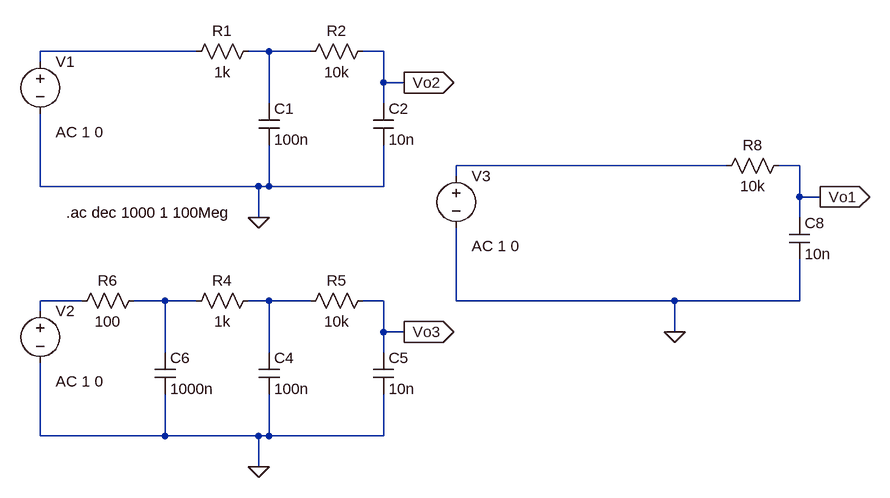
[diagram p0: schematic q4.asc]
q4.asc, the LTspice schematic file:
Version 4
SHEET 1 880 680
WIRE -288 -32 -528 -32
WIRE -176 -32 -208 -32
WIRE -112 -32 -176 -32
WIRE 0 -32 -32 -32
WIRE -528 -16 -528 -32
WIRE 0 16 0 -32
WIRE 32 16 0 16
WIRE -176 48 -176 -32
WIRE 0 48 0 16
WIRE 528 144 112 144
WIRE 640 144 608 144
WIRE 112 160 112 144
WIRE -528 176 -528 64
WIRE -192 176 -528 176
WIRE -176 176 -176 112
WIRE -176 176 -192 176
WIRE 0 176 0 112
WIRE 0 176 -176 176
WIRE 640 192 640 144
WIRE 672 192 640 192
WIRE -192 224 -192 176
WIRE 640 224 640 192
WIRE -464 352 -528 352
WIRE -336 352 -384 352
WIRE -288 352 -336 352
WIRE -176 352 -208 352
WIRE -112 352 -176 352
WIRE 0 352 -32 352
WIRE 112 352 112 240
WIRE 448 352 112 352
WIRE 640 352 640 288
WIRE 640 352 448 352
WIRE -528 368 -528 352
WIRE 0 400 0 352
WIRE 32 400 0 400
WIRE 448 400 448 352
WIRE -336 432 -336 352
WIRE -176 432 -176 352
WIRE 0 432 0 400
WIRE -528 560 -528 448
WIRE -336 560 -336 496
WIRE -336 560 -528 560
WIRE -192 560 -336 560
WIRE -176 560 -176 496
WIRE -176 560 -192 560
WIRE 0 560 0 496
WIRE 0 560 -176 560
WIRE -192 608 -192 560
FLAG -192 224 0
FLAG 32 16 Vo2
IOPIN 32 16 Out
FLAG -192 608 0
FLAG 32 400 Vo3
IOPIN 32 400 Out
FLAG 448 400 0
FLAG 672 192 Vo1
IOPIN 672 192 Out
SYMBOL voltage -528 -32 R0
WINDOW 123 24 124 Left 2
WINDOW 39 0 0 Left 0
SYMATTR Value2 AC 1 0
SYMATTR InstName V1
SYMATTR Value ""
SYMBOL res -192 -48 R90
WINDOW 0 0 56 VBottom 2
WINDOW 3 32 56 VTop 2
SYMATTR InstName R1
SYMATTR Value 1k
SYMBOL res -16 -48 R90
WINDOW 0 0 56 VBottom 2
WINDOW 3 32 56 VTop 2
SYMATTR InstName R2
SYMATTR Value 10k
SYMBOL cap -192 48 R0
SYMATTR InstName C1
SYMATTR Value 100n
SYMBOL cap -16 48 R0
SYMATTR InstName C2
SYMATTR Value 10n
SYMBOL voltage -528 352 R0
WINDOW 123 24 124 Left 2
WINDOW 39 0 0 Left 0
SYMATTR Value2 AC 1 0
SYMATTR InstName V2
SYMATTR Value ""
SYMBOL res -192 336 R90
WINDOW 0 0 56 VBottom 2
WINDOW 3 32 56 VTop 2
SYMATTR InstName R4
SYMATTR Value 1k
SYMBOL res -16 336 R90
WINDOW 0 0 56 VBottom 2
WINDOW 3 32 56 VTop 2
SYMATTR InstName R5
SYMATTR Value 10k
SYMBOL cap -192 432 R0
SYMATTR InstName C4
SYMATTR Value 100n
SYMBOL cap -16 432 R0
SYMATTR InstName C5
SYMATTR Value 10n
SYMBOL cap -352 432 R0
SYMATTR InstName C6
SYMATTR Value 1000n
SYMBOL res -368 336 R90
WINDOW 0 0 56 VBottom 2
WINDOW 3 32 56 VTop 2
SYMATTR InstName R6
SYMATTR Value 100
SYMBOL voltage 112 144 R0
WINDOW 123 24 124 Left 2
WINDOW 39 0 0 Left 0
SYMATTR Value2 AC 1 0
SYMATTR InstName V3
SYMATTR Value ""
SYMBOL res 624 128 R90
WINDOW 0 0 56 VBottom 2
WINDOW 3 32 56 VTop 2
SYMATTR InstName R8
SYMATTR Value 10k
SYMBOL cap 624 224 R0
SYMATTR InstName C8
SYMATTR Value 10n
TEXT -488 216 Left 2 !.ac dec 1000 1 100Meg

The netlist it stands for:
* q4.asc
V1 N001 0 AC 1 0
R1 N002 N001 1k
R2 Vo2 N002 10k
C1 N002 0 100n
C2 Vo2 0 10n
V2 N004 0 AC 1 0
R4 N006 N005 1k
R5 Vo3 N006 10k
C4 N006 0 100n
C5 Vo3 0 10n
C6 N005 0 1000n
R6 N005 N004 100
V3 N003 0 AC 1 0
R8 Vo1 N003 10k
C8 Vo1 0 10n
.ac dec 1000 1 100Meg
.backanno
.end